# EAGLE schematic schaltplan (EAGLE 6.5.0)
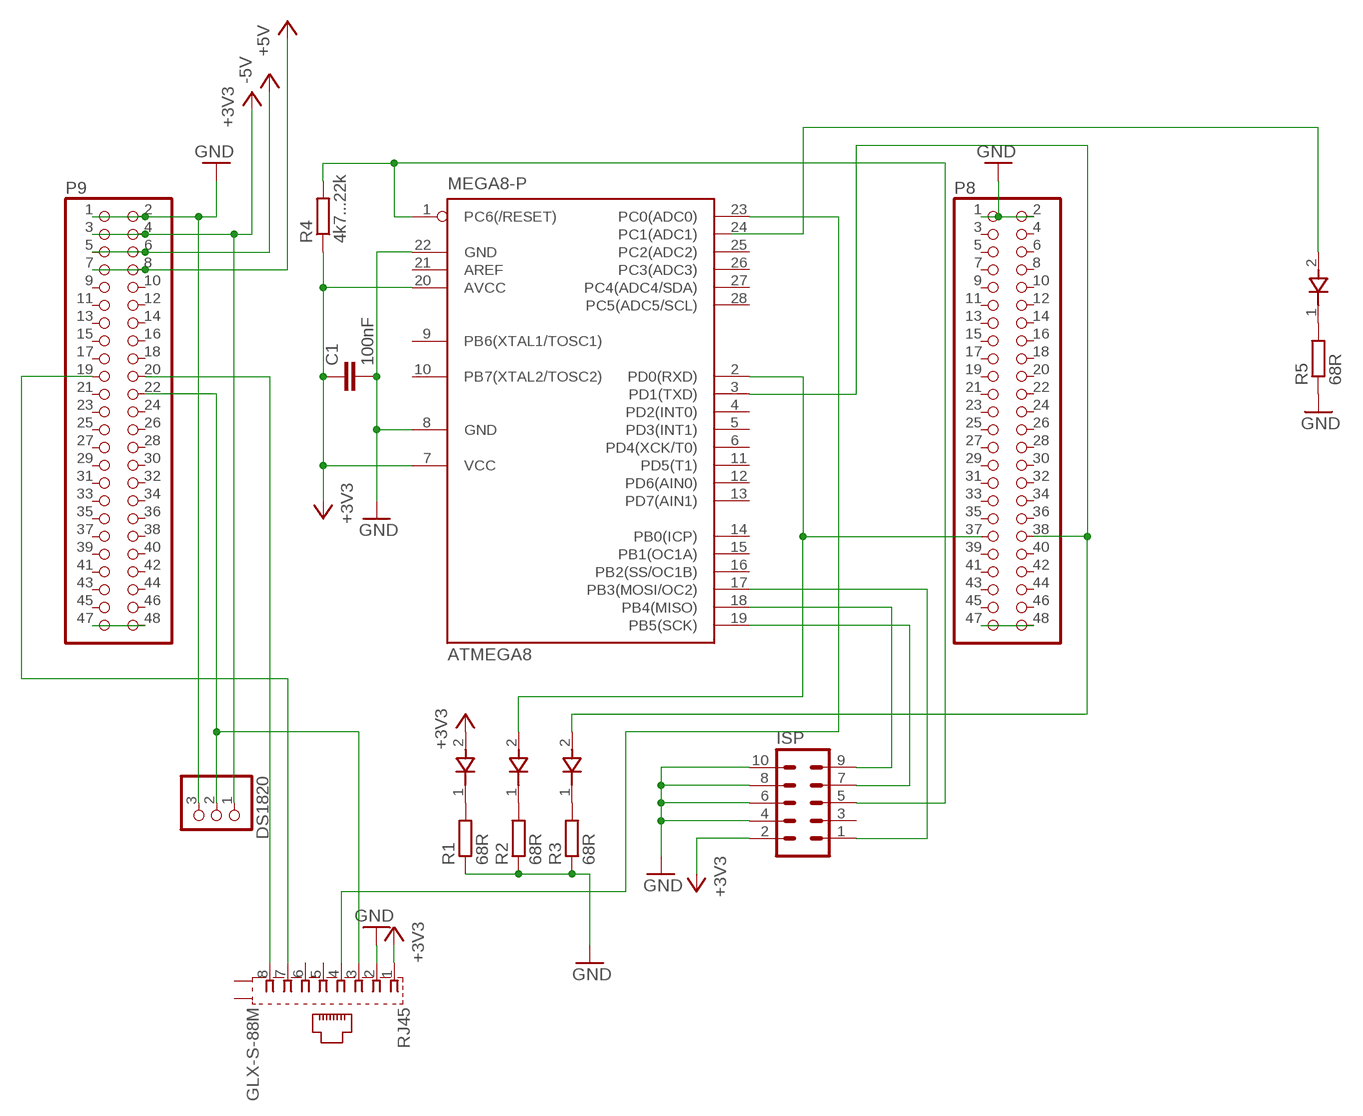
[diagram p0: schematic, sheet 1]

## Parts
ATMEGA8  MEGA8-P  [DIL28-3]
C1  100nF  C-EUC0805  [C0805]
DS1820  PINHD-1X3  [1X03]
ISP  ML10  [ML10]
P8  PINHD-2X24  [2X24]
P9  PINHD-2X24  [2X24]
R1  68R  R-EU_R1206  [R1206]
R2  68R  R-EU_R1206  [R1206]
R3  68R  R-EU_R1206  [R1206]
R4  4k7...22k  R-EU_R1206  [R1206]
R5  68R  R-EU_R1206  [R1206]
RJ45  GLX-S-88M  [GLX-S-88M]
U$1  LOL_LED  [LOL_LED]
U$2  LOL_LED  [LOL_LED]
U$3  LOL_LED  [LOL_LED]
U$4  LOL_LED  [LOL_LED]

## Nets
+3V3: ATMEGA8.7(VCC) ATMEGA8.20(AVCC) C1.1 DS1820.1 ISP.2 P9.3 P9.4 R4.1 RJ45.1 U$1.2(POS)
+5V: P9.7 P9.8
-5V: P9.5 P9.6
FILL: P8.47 P8.48 P9.47 P9.48
GND: ATMEGA8.8(GND) ATMEGA8.22(GND) C1.2 DS1820.3 ISP.4 ISP.6 ISP.8 ISP.10 P8.1 P8.2 P9.1 P9.2 R1.1 R2.1 R3.1 R5.1 RJ45.2
N$1: P9.19 RJ45.7
N$2: P9.20 RJ45.8
N$3: DS1820.2 P9.22 RJ45.3
N$4: ATMEGA8.23(PC0(ADC0)) RJ45.4
N$5: ATMEGA8.2(PD0(RXD)) P8.37 U$2.2(POS)
N$6: ATMEGA8.3(PD1(TXD)) P8.38 U$3.2(POS)
N$7: ATMEGA8.17(PB3(MOSI/OC2)) ISP.1
N$8: ATMEGA8.1(PC6(/RESET)) ISP.5 R4.2
N$9: ATMEGA8.19(PB5(SCK)) ISP.7
N$10: ATMEGA8.18(PB4(MISO)) ISP.9
N$11: R1.2 U$1.1(NEG)
N$12: R2.2 U$2.1(NEG)
N$13: R3.2 U$3.1(NEG)
N$14: R5.2 U$4.1(NEG)
N$15: U$4.2(POS)
Unconnected: ATMEGA8.4(PD2(INT0)) ATMEGA8.5(PD3(INT1)) ATMEGA8.6(PD4(XCK/T0)) ATMEGA8.9(PB6(XTAL1/TOSC1)) ATMEGA8.10(PB7(XTAL2/TOSC2)) ATMEGA8.11(PD5(T1)) ATMEGA8.12(PD6(AIN0)) ATMEGA8.13(PD7(AIN1)) ATMEGA8.14(PB0(ICP)) ATMEGA8.15(PB1(OC1A)) ATMEGA8.16(PB2(SS/OC1B)) ATMEGA8.21(AREF) ATMEGA8.24(PC1(ADC1)) ATMEGA8.25(PC2(ADC2)) ATMEGA8.26(PC3(ADC3)) ATMEGA8.27(PC4(ADC4/SDA)) ATMEGA8.28(PC5(ADC5/SCL)) ISP.3 P8.3 P8.4 P8.5 P8.6 P8.7 P8.8 P8.9 P8.10 P8.11 P8.12 P8.13 P8.14 P8.15 P8.16 P8.17 P8.18 P8.19 P8.20 P8.21 P8.22 P8.23 P8.24 P8.25 P8.26 P8.27 P8.28 P8.29 P8.30 P8.31 P8.32 P8.33 P8.34 P8.35 P8.36 P8.39 P8.40 P8.41 P8.42 P8.43 P8.44 P8.45 P8.46 P9.9 P9.10 P9.11 P9.12 P9.13 P9.14 P9.15 P9.16 P9.17 P9.18 P9.21 P9.23 P9.24 P9.25 P9.26 P9.27 P9.28 P9.29 P9.30 P9.31 P9.32 P9.33 P9.34 P9.35 P9.36 P9.37 P9.38 P9.39 P9.40 P9.41 P9.42 P9.43 P9.44 P9.45 P9.46 RJ45.5 RJ45.6 RJ45.S1 RJ45.S2

## Library data of the parts
ATMEGA8 = atmel:MEGA8-P: MICROCONTROLLER 8 Kbytes FLASH, 1 kbytes SRAM, 512 bytes EEPROM, USART, 4-channel 10 bit ADC, 2-channel 8 bit ADC Pin compatible with Atmega48, ATMega88, ATMega168 Source: avr.lbr; OC_FARNELL: unknown; OC_NEWARK: unknown
C1 = rcl:C-EU: CAPACITOR, European symbol
DS1820 = pinhead:PINHD-1X3: PIN HEADER
ISP = con-ml:ML10: HARTING; OC_FARNELL: unknown; OC_NEWARK: unknown
P8 P9 = pinhead:PINHD-2X24: PIN HEADER
R1-R5 = rcl:R-EU_: RESISTOR, European symbol
RJ45 = con-kycon:GLX-S-88M: Mod. Jack, Right Angle, 8 posiotion, 8 contatcs RJ45 Source: GLX-S-88M.pdf; OC_FARNELL: unknown; OC_NEWARK: unknown
U$1-U$4 = 20140722-180730-led:LOL_LED